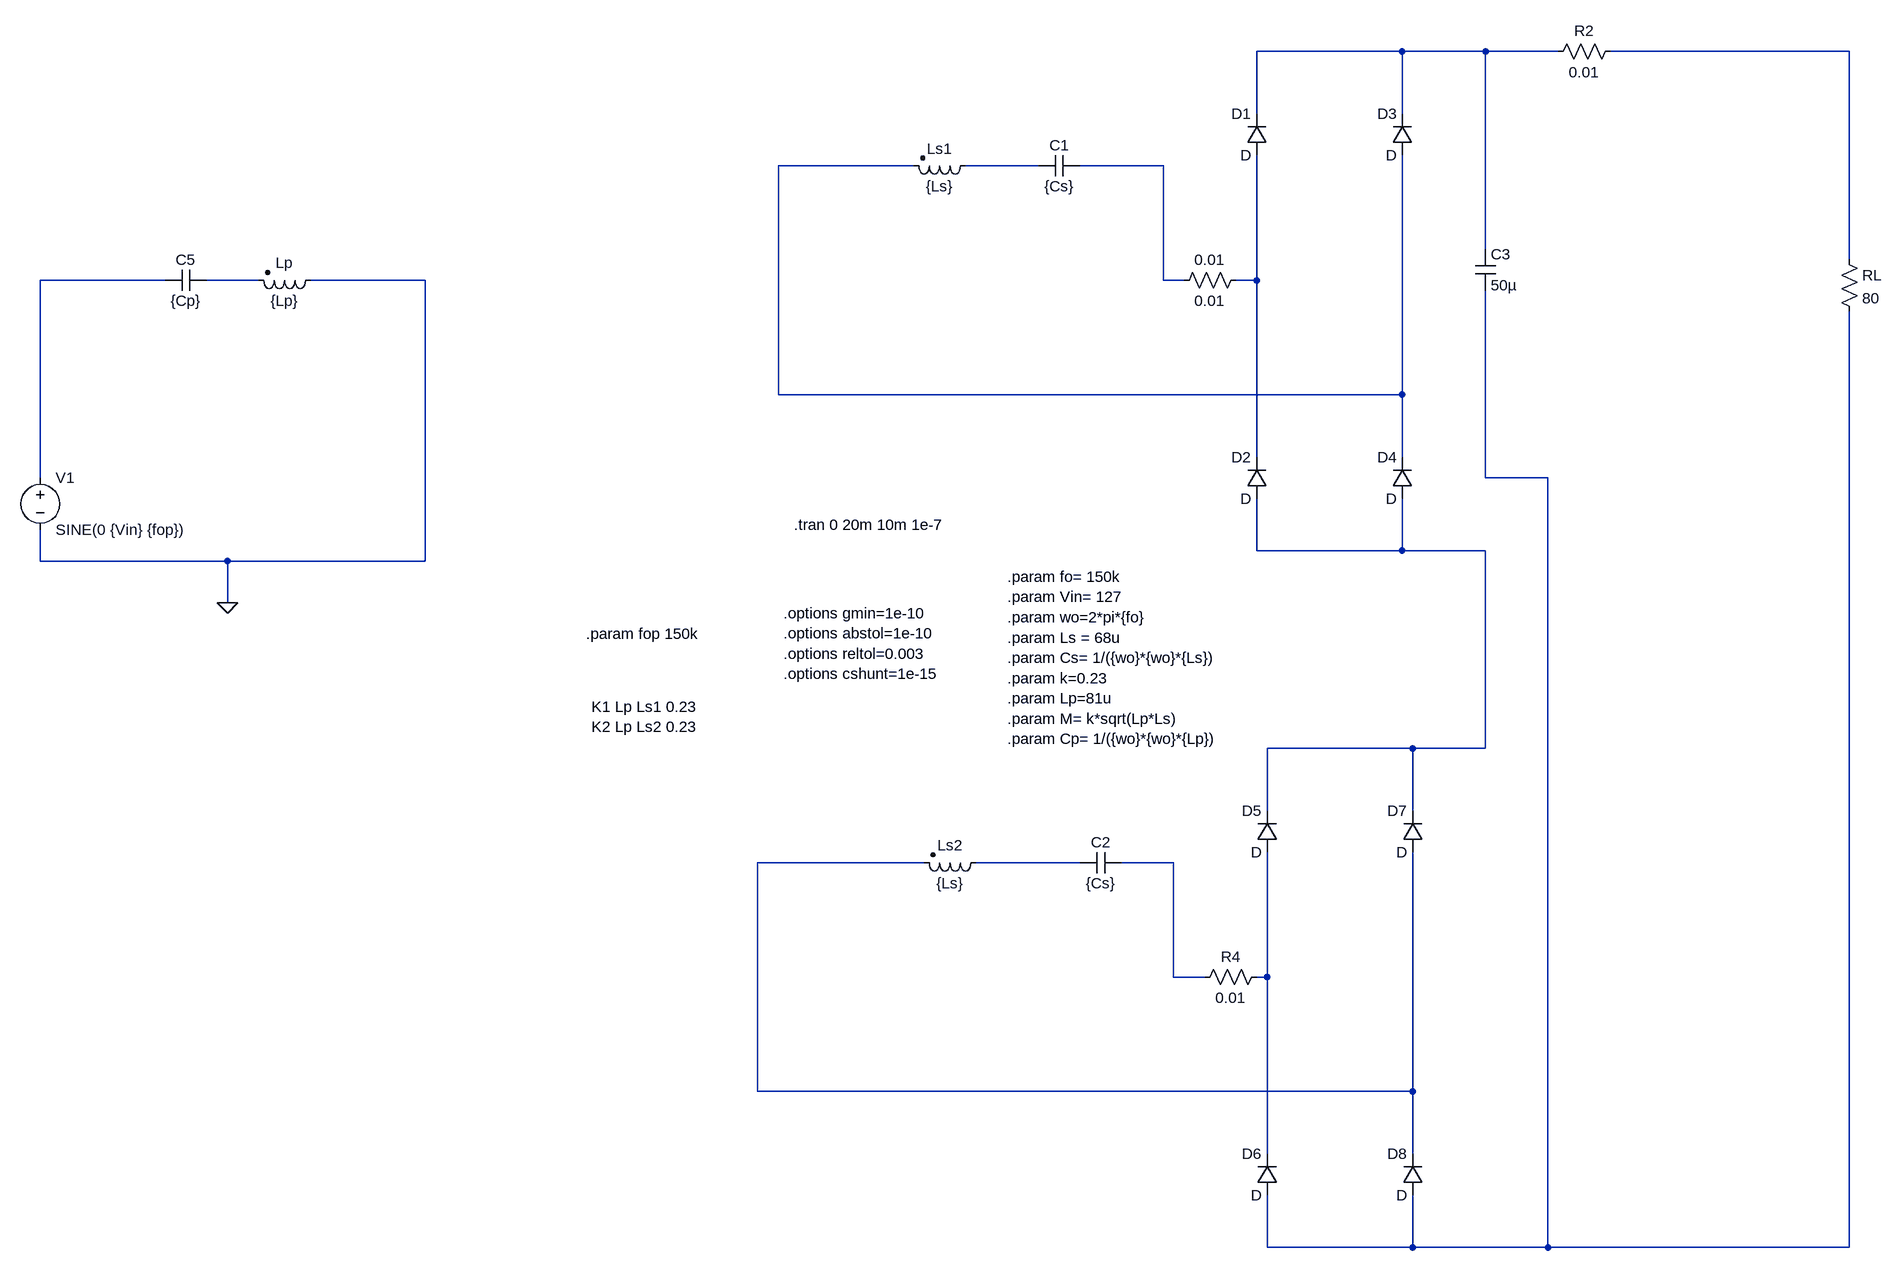
[diagram p0: schematic series-compensation-series_Tx-Rx.asc]
series-compensation-series_Tx-Rx.asc, the LTspice schematic file:
Version 4
SHEET 1 2752 1872
WIRE 1936 -240 1712 -240
WIRE 2064 -240 1936 -240
WIRE 2176 -240 2064 -240
WIRE 2624 -240 2256 -240
WIRE 1712 -144 1712 -240
WIRE 1936 -144 1936 -240
WIRE 1184 -64 976 -64
WIRE 1376 -64 1264 -64
WIRE 1568 -64 1440 -64
WIRE 2064 64 2064 -240
WIRE 2624 80 2624 -240
WIRE 32 112 -160 112
WIRE 176 112 96 112
WIRE 432 112 256 112
WIRE 1568 112 1568 -64
WIRE 1600 112 1568 112
WIRE 1712 112 1712 -80
WIRE 1712 112 1680 112
WIRE 976 288 976 -64
WIRE 1936 288 1936 -80
WIRE 1936 288 976 288
WIRE 1712 384 1712 112
WIRE 1936 384 1936 288
WIRE -160 416 -160 112
WIRE 2064 416 2064 128
WIRE 2160 416 2064 416
WIRE 1712 528 1712 448
WIRE 1936 528 1936 448
WIRE 1936 528 1712 528
WIRE 2064 528 1936 528
WIRE -160 544 -160 496
WIRE 128 544 -160 544
WIRE 432 544 432 112
WIRE 432 544 128 544
WIRE 128 608 128 544
WIRE 1952 832 1728 832
WIRE 2064 832 2064 528
WIRE 2064 832 1952 832
WIRE 1728 928 1728 832
WIRE 1952 928 1952 832
WIRE 1200 1008 944 1008
WIRE 1440 1008 1280 1008
WIRE 1584 1008 1504 1008
WIRE 1584 1184 1584 1008
WIRE 1632 1184 1584 1184
WIRE 1728 1184 1728 992
WIRE 1728 1184 1712 1184
WIRE 944 1360 944 1008
WIRE 1952 1360 1952 992
WIRE 1952 1360 944 1360
WIRE 1728 1456 1728 1184
WIRE 1952 1456 1952 1360
WIRE 1728 1600 1728 1520
WIRE 1952 1600 1952 1520
WIRE 1952 1600 1728 1600
WIRE 2160 1600 2160 416
WIRE 2160 1600 1952 1600
WIRE 2624 1600 2624 160
WIRE 2624 1600 2160 1600
FLAG 128 608 0
SYMBOL voltage -160 400 R0
WINDOW 123 0 0 Left 0
WINDOW 39 0 0 Left 0
SYMATTR InstName V1
SYMATTR Value SINE(0 {Vin} {fop})
SYMBOL ind2 1280 -80 R90
WINDOW 0 5 56 VBottom 2
WINDOW 3 32 56 VTop 2
SYMATTR InstName Ls1
SYMATTR Value {Ls}
SYMATTR Type ind
SYMBOL cap 1376 -48 R270
WINDOW 0 32 32 VTop 2
WINDOW 3 0 32 VBottom 2
SYMATTR InstName C1
SYMATTR Value {Cs}
SYMBOL diode 1728 -80 R180
WINDOW 0 24 64 Left 2
WINDOW 3 24 0 Left 2
SYMATTR InstName D1
SYMBOL diode 1728 448 R180
WINDOW 0 24 64 Left 2
WINDOW 3 24 0 Left 2
SYMATTR InstName D2
SYMBOL diode 1952 -80 R180
WINDOW 0 24 64 Left 2
WINDOW 3 24 0 Left 2
SYMATTR InstName D3
SYMBOL diode 1952 448 R180
WINDOW 0 24 64 Left 2
WINDOW 3 24 0 Left 2
SYMATTR InstName D4
SYMBOL res 2608 64 R0
SYMATTR InstName RL
SYMATTR Value 80
SYMBOL ind2 1296 992 R90
WINDOW 0 5 56 VBottom 2
WINDOW 3 32 56 VTop 2
SYMATTR InstName Ls2
SYMATTR Value {Ls}
SYMATTR Type ind
SYMBOL cap 1440 1024 R270
WINDOW 0 32 32 VTop 2
WINDOW 3 0 32 VBottom 2
SYMATTR InstName C2
SYMATTR Value {Cs}
SYMBOL diode 1744 992 R180
WINDOW 0 24 64 Left 2
WINDOW 3 24 0 Left 2
SYMATTR InstName D5
SYMBOL diode 1744 1520 R180
WINDOW 0 24 64 Left 2
WINDOW 3 24 0 Left 2
SYMATTR InstName D6
SYMBOL diode 1968 992 R180
WINDOW 0 24 64 Left 2
WINDOW 3 24 0 Left 2
SYMATTR InstName D7
SYMBOL diode 1968 1520 R180
WINDOW 0 24 64 Left 2
WINDOW 3 24 0 Left 2
SYMATTR InstName D8
SYMBOL cap 2048 64 R0
SYMATTR InstName C3
SYMATTR Value 50µ
SYMBOL res 2272 -256 R90
WINDOW 0 0 56 VBottom 2
WINDOW 3 32 56 VTop 2
SYMATTR InstName R2
SYMATTR Value 0.01
SYMBOL res 1728 1168 R90
WINDOW 0 0 56 VBottom 2
WINDOW 3 32 56 VTop 2
SYMATTR InstName R4
SYMATTR Value 0.01
SYMBOL res 1696 96 R90
WINDOW 0 0 56 VBottom 2
WINDOW 3 32 56 VTop 2
SYMATTR InstName 0.01
SYMATTR Value 0.01
SYMBOL ind2 272 96 R90
WINDOW 0 5 56 VBottom 2
WINDOW 3 32 56 VTop 2
SYMATTR InstName Lp
SYMATTR Value {Lp}
SYMATTR Type ind
SYMBOL cap 96 96 R90
WINDOW 0 0 32 VBottom 2
WINDOW 3 32 32 VTop 2
SYMATTR InstName C5
SYMATTR Value {Cp}
TEXT 1000 488 Left 2 !.tran 0 20m 10m 1e-7
TEXT 680 656 Left 2 !.param fop 150k
TEXT 1328 568 Left 2 !.param fo= 150k\n.param Vin= 127\n.param wo=2*pi*{fo}\n.param Ls = 68u\n.param Cs= 1/({wo}*{wo}*{Ls})\n.param k=0.23\n.param Lp=81u\n.param M= k*sqrt(Lp*Ls)\n.param Cp= 1/({wo}*{wo}*{Lp})
TEXT 984 624 Left 2 !.options gmin=1e-10\n.options abstol=1e-10\n.options reltol=0.003\n.options cshunt=1e-15
TEXT 688 768 Left 2 !K1 Lp Ls1 0.23\nK2 Lp Ls2 0.23

The netlist it stands for:
* series-compensation-series_Tx-Rx.asc
V1 N006 0 SINE(0 {Vin} {fop})
Ls1 N004 N003 {Ls}
C1 N004 N005 {Cs}
D1 N008 N001 D
D2 N010 N008 D
D3 N003 N001 D
D4 N010 N003 D
RL N002 N009 80
Ls2 N012 N011 {Ls}
C2 N012 N013 {Cs}
D5 N014 N010 D
D6 N009 N014 D
D7 N011 N010 D
D8 N009 N011 D
C3 N001 N009 50µ
R2 N002 N001 0.01
R4 N014 N013 0.01
R§0.01 N008 N005 0.01
Lp 0 N007 {Lp}
C5 N007 N006 {Cp}
.model D D
.lib standard.dio
.tran 0 20m 10m 1e-7
.param fop 150k
.param fo= 150k
.param Vin= 127
.param wo=2*pi*{fo}
.param Ls = 68u
.param Cs= 1/({wo}*{wo}*{Ls})
.param k=0.23
.param Lp=81u
.param M= k*sqrt(Lp*Ls)
.param Cp= 1/({wo}*{wo}*{Lp})
.options gmin=1e-10
.options abstol=1e-10
.options reltol=0.003
.options cshunt=1e-15
K1 Lp Ls1 0.23
K2 Lp Ls2 0.23
.backanno
.end